# Altium project SkinBot_tether_wire_board_v1.PrjPcb
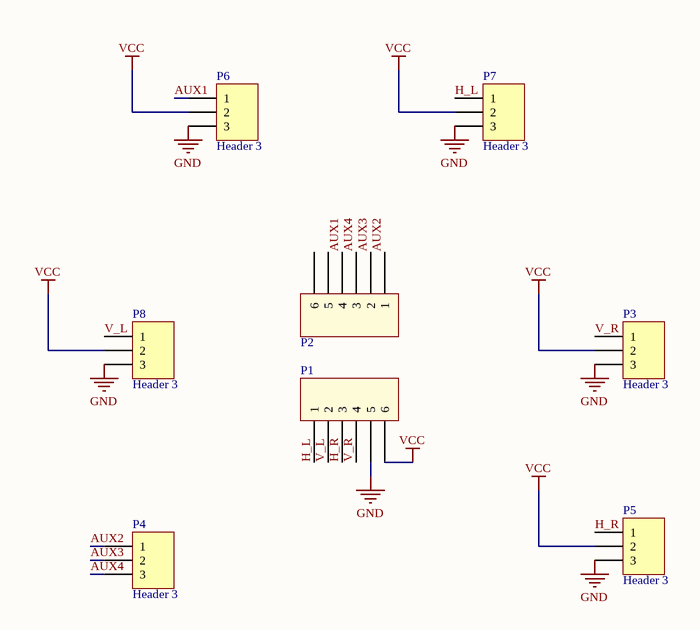
[diagram p0: Schematic_skinBot_tether_wire_board_v1.SchDoc]
1 sheet, 8 parts. Net scope: global (net labels, ports and power ports of the same name join across sheets).
Board file: PCB_skinBot_tether_wire_board_v1.PcbDoc

## Sheet Schematic_skinBot_tether_wire_board_v1.SchDoc: SkinBot Tether Board
size A; Revision: 1

### Parts
P1  JST SH 6  [JST SH 6 TOP ENTRY 1MM]  (value not drawn)
P2  JST SH 6  [JST SH 6 TOP ENTRY 1MM]  (value not drawn)
P3  Header 3  [HDR1X3]
P4  Header 3  [HDR1X3]
P5  Header 3  [HDR1X3]
P6  Header 3  [HDR1X3]
P7  Header 3  [HDR1X3]
P8  Header 3  [HDR1X3]

### Nets
GND: P1.5 P3.3 P5.3 P6.3 P7.3 P8.3
VCC: P1.6 P3.2 P5.2 P6.2 P7.2 P8.2
AUX1: P2.4 P6.1
AUX2: P2.1 P4.1
AUX3: P2.2 P4.2
AUX4: P2.3 P4.3
H_L: P1.1 P7.1
H_R: P1.3 P5.1
V_L: P1.2 P8.1
V_R: P1.4 P3.1

Not connected (* = marked no-connect by the designer): P2 5 6

### Library data of the parts
P1 P2 = JST SH 6: Sparkfun part number: PRT-10210
P3-P8 = Header 3: Header, 3-Pin; LatestRevisionDate: 17-Jul-2002; LatestRevisionNote: Re-released for DXP Platform.; Publisher: Altium Limited